# EAGLE design proto-small (EAGLE 6.5.0)
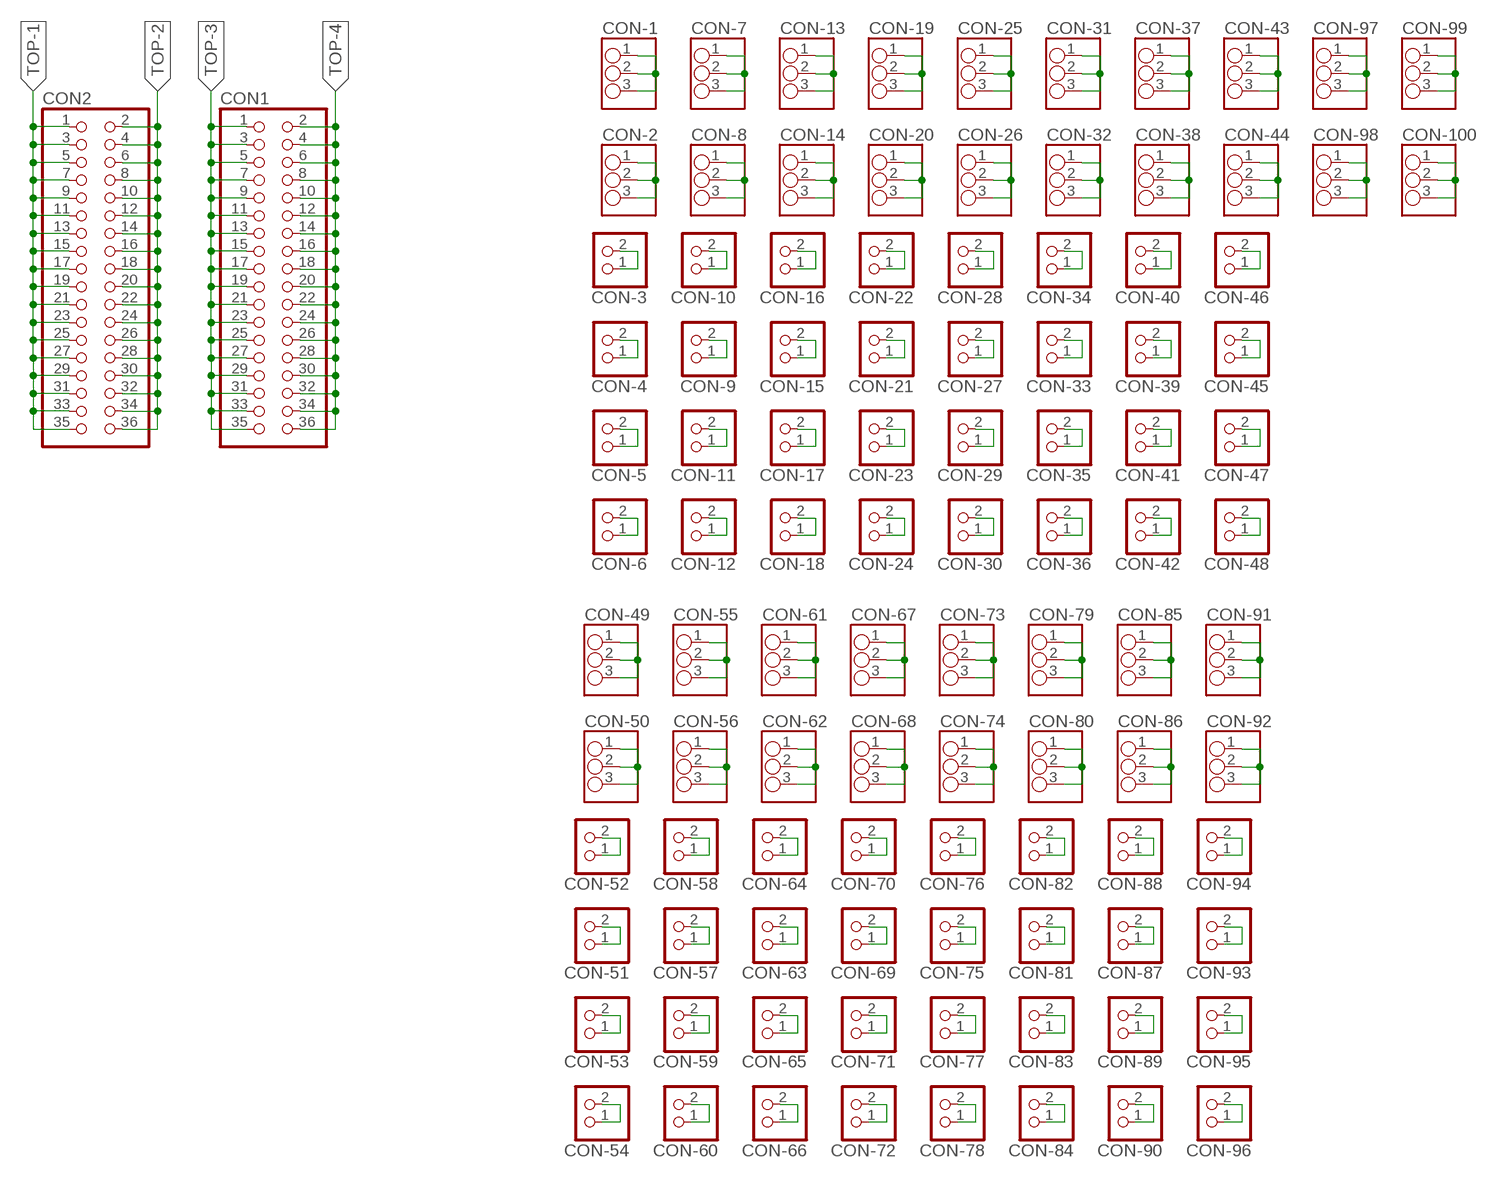
[diagram p0: schematic, sheet 1]

## Parts
CON1  GENERIC-2X18  [PINHEADER-100MIL-2X18-NOSILK]
CON2  GENERIC-2X18  [PINHEADER-100MIL-2X18-NOSILK]
CON-1  GENERIC-1X3  [PINHEADER-100MIL-1X3-NOSILK]
CON-2  GENERIC-1X3  [PINHEADER-100MIL-1X3-NOSILK]
CON-3  GENERIC-1X2  [PINHEADER-100MIL-1X2-NOSILK]
CON-4  GENERIC-1X2  [PINHEADER-100MIL-1X2-NOSILK]
CON-5  GENERIC-1X2  [PINHEADER-100MIL-1X2-NOSILK]
CON-6  GENERIC-1X2  [PINHEADER-100MIL-1X2-NOSILK]
CON-7  GENERIC-1X3  [PINHEADER-100MIL-1X3-NOSILK]
CON-8  GENERIC-1X3  [PINHEADER-100MIL-1X3-NOSILK]
CON-9  GENERIC-1X2  [PINHEADER-100MIL-1X2-NOSILK]
CON-10  GENERIC-1X2  [PINHEADER-100MIL-1X2-NOSILK]
CON-11  GENERIC-1X2  [PINHEADER-100MIL-1X2-NOSILK]
CON-12  GENERIC-1X2  [PINHEADER-100MIL-1X2-NOSILK]
CON-13  GENERIC-1X3  [PINHEADER-100MIL-1X3-NOSILK]
CON-14  GENERIC-1X3  [PINHEADER-100MIL-1X3-NOSILK]
CON-15  GENERIC-1X2  [PINHEADER-100MIL-1X2-NOSILK]
CON-16  GENERIC-1X2  [PINHEADER-100MIL-1X2-NOSILK]
CON-17  GENERIC-1X2  [PINHEADER-100MIL-1X2-NOSILK]
CON-18  GENERIC-1X2  [PINHEADER-100MIL-1X2-NOSILK]
CON-19  GENERIC-1X3  [PINHEADER-100MIL-1X3-NOSILK]
CON-20  GENERIC-1X3  [PINHEADER-100MIL-1X3-NOSILK]
CON-21  GENERIC-1X2  [PINHEADER-100MIL-1X2-NOSILK]
CON-22  GENERIC-1X2  [PINHEADER-100MIL-1X2-NOSILK]
CON-23  GENERIC-1X2  [PINHEADER-100MIL-1X2-NOSILK]
CON-24  GENERIC-1X2  [PINHEADER-100MIL-1X2-NOSILK]
CON-25  GENERIC-1X3  [PINHEADER-100MIL-1X3-NOSILK]
CON-26  GENERIC-1X3  [PINHEADER-100MIL-1X3-NOSILK]
CON-27  GENERIC-1X2  [PINHEADER-100MIL-1X2-NOSILK]
CON-28  GENERIC-1X2  [PINHEADER-100MIL-1X2-NOSILK]
CON-29  GENERIC-1X2  [PINHEADER-100MIL-1X2-NOSILK]
CON-30  GENERIC-1X2  [PINHEADER-100MIL-1X2-NOSILK]
CON-31  GENERIC-1X3  [PINHEADER-100MIL-1X3-NOSILK]
CON-32  GENERIC-1X3  [PINHEADER-100MIL-1X3-NOSILK]
CON-33  GENERIC-1X2  [PINHEADER-100MIL-1X2-NOSILK]
CON-34  GENERIC-1X2  [PINHEADER-100MIL-1X2-NOSILK]
CON-35  GENERIC-1X2  [PINHEADER-100MIL-1X2-NOSILK]
CON-36  GENERIC-1X2  [PINHEADER-100MIL-1X2-NOSILK]
CON-37  GENERIC-1X3  [PINHEADER-100MIL-1X3-NOSILK]
CON-38  GENERIC-1X3  [PINHEADER-100MIL-1X3-NOSILK]
CON-39  GENERIC-1X2  [PINHEADER-100MIL-1X2-NOSILK]
CON-40  GENERIC-1X2  [PINHEADER-100MIL-1X2-NOSILK]
CON-41  GENERIC-1X2  [PINHEADER-100MIL-1X2-NOSILK]
CON-42  GENERIC-1X2  [PINHEADER-100MIL-1X2-NOSILK]
CON-43  GENERIC-1X3  [PINHEADER-100MIL-1X3-NOSILK]
CON-44  GENERIC-1X3  [PINHEADER-100MIL-1X3-NOSILK]
CON-45  GENERIC-1X2  [PINHEADER-100MIL-1X2-NOSILK]
CON-46  GENERIC-1X2  [PINHEADER-100MIL-1X2-NOSILK]
CON-47  GENERIC-1X2  [PINHEADER-100MIL-1X2-NOSILK]
CON-48  GENERIC-1X2  [PINHEADER-100MIL-1X2-NOSILK]
CON-49  GENERIC-1X3  [PINHEADER-100MIL-1X3-NOSILK]
CON-50  GENERIC-1X3  [PINHEADER-100MIL-1X3-NOSILK]
CON-51  GENERIC-1X2  [PINHEADER-100MIL-1X2-NOSILK]
CON-52  GENERIC-1X2  [PINHEADER-100MIL-1X2-NOSILK]
CON-53  GENERIC-1X2  [PINHEADER-100MIL-1X2-NOSILK]
CON-54  GENERIC-1X2  [PINHEADER-100MIL-1X2-NOSILK]
CON-55  GENERIC-1X3  [PINHEADER-100MIL-1X3-NOSILK]
CON-56  GENERIC-1X3  [PINHEADER-100MIL-1X3-NOSILK]
CON-57  GENERIC-1X2  [PINHEADER-100MIL-1X2-NOSILK]
CON-58  GENERIC-1X2  [PINHEADER-100MIL-1X2-NOSILK]
CON-59  GENERIC-1X2  [PINHEADER-100MIL-1X2-NOSILK]
CON-60  GENERIC-1X2  [PINHEADER-100MIL-1X2-NOSILK]
CON-61  GENERIC-1X3  [PINHEADER-100MIL-1X3-NOSILK]
CON-62  GENERIC-1X3  [PINHEADER-100MIL-1X3-NOSILK]
CON-63  GENERIC-1X2  [PINHEADER-100MIL-1X2-NOSILK]
CON-64  GENERIC-1X2  [PINHEADER-100MIL-1X2-NOSILK]
CON-65  GENERIC-1X2  [PINHEADER-100MIL-1X2-NOSILK]
CON-66  GENERIC-1X2  [PINHEADER-100MIL-1X2-NOSILK]
CON-67  GENERIC-1X3  [PINHEADER-100MIL-1X3-NOSILK]
CON-68  GENERIC-1X3  [PINHEADER-100MIL-1X3-NOSILK]
CON-69  GENERIC-1X2  [PINHEADER-100MIL-1X2-NOSILK]
CON-70  GENERIC-1X2  [PINHEADER-100MIL-1X2-NOSILK]
CON-71  GENERIC-1X2  [PINHEADER-100MIL-1X2-NOSILK]
CON-72  GENERIC-1X2  [PINHEADER-100MIL-1X2-NOSILK]
CON-73  GENERIC-1X3  [PINHEADER-100MIL-1X3-NOSILK]
CON-74  GENERIC-1X3  [PINHEADER-100MIL-1X3-NOSILK]
CON-75  GENERIC-1X2  [PINHEADER-100MIL-1X2-NOSILK]
CON-76  GENERIC-1X2  [PINHEADER-100MIL-1X2-NOSILK]
CON-77  GENERIC-1X2  [PINHEADER-100MIL-1X2-NOSILK]
CON-78  GENERIC-1X2  [PINHEADER-100MIL-1X2-NOSILK]
CON-79  GENERIC-1X3  [PINHEADER-100MIL-1X3-NOSILK]
CON-80  GENERIC-1X3  [PINHEADER-100MIL-1X3-NOSILK]
CON-81  GENERIC-1X2  [PINHEADER-100MIL-1X2-NOSILK]
CON-82  GENERIC-1X2  [PINHEADER-100MIL-1X2-NOSILK]
CON-83  GENERIC-1X2  [PINHEADER-100MIL-1X2-NOSILK]
CON-84  GENERIC-1X2  [PINHEADER-100MIL-1X2-NOSILK]
CON-85  GENERIC-1X3  [PINHEADER-100MIL-1X3-NOSILK]
CON-86  GENERIC-1X3  [PINHEADER-100MIL-1X3-NOSILK]
CON-87  GENERIC-1X2  [PINHEADER-100MIL-1X2-NOSILK]
CON-88  GENERIC-1X2  [PINHEADER-100MIL-1X2-NOSILK]
CON-89  GENERIC-1X2  [PINHEADER-100MIL-1X2-NOSILK]
CON-90  GENERIC-1X2  [PINHEADER-100MIL-1X2-NOSILK]
CON-91  GENERIC-1X3  [PINHEADER-100MIL-1X3-NOSILK]
CON-92  GENERIC-1X3  [PINHEADER-100MIL-1X3-NOSILK]
CON-93  GENERIC-1X2  [PINHEADER-100MIL-1X2-NOSILK]
CON-94  GENERIC-1X2  [PINHEADER-100MIL-1X2-NOSILK]
CON-95  GENERIC-1X2  [PINHEADER-100MIL-1X2-NOSILK]
CON-96  GENERIC-1X2  [PINHEADER-100MIL-1X2-NOSILK]
CON-97  GENERIC-1X3  [PINHEADER-100MIL-1X3-NOSILK]
CON-98  GENERIC-1X3  [PINHEADER-100MIL-1X3-NOSILK]
CON-99  GENERIC-1X3  [PINHEADER-100MIL-1X3-NOSILK]
CON-100  GENERIC-1X3  [PINHEADER-100MIL-1X3-NOSILK]

## Nets
N$1: CON-1.1 CON-1.2 CON-1.3
N$2: CON-2.1 CON-2.2 CON-2.3
N$3: CON-3.1 CON-3.2
N$4: CON-7.1 CON-7.2 CON-7.3
N$5: CON-5.1 CON-5.2
N$6: CON-6.1 CON-6.2
N$7: CON-8.1 CON-8.2 CON-8.3
N$8: CON-10.1 CON-10.2
N$9: CON-11.1 CON-11.2
N$10: CON-12.1 CON-12.2
N$11: CON-13.1 CON-13.2 CON-13.3
N$12: CON-14.1 CON-14.2 CON-14.3
N$13: CON-16.1 CON-16.2
N$14: CON-17.1 CON-17.2
N$15: CON-18.1 CON-18.2
N$16: CON-19.1 CON-19.2 CON-19.3
N$17: CON-20.1 CON-20.2 CON-20.3
N$18: CON-22.1 CON-22.2
N$19: CON-23.1 CON-23.2
N$20: CON-24.1 CON-24.2
N$21: CON-25.1 CON-25.2 CON-25.3
N$22: CON-26.1 CON-26.2 CON-26.3
N$23: CON-28.1 CON-28.2
N$24: CON-29.1 CON-29.2
N$25: CON-30.1 CON-30.2
N$26: CON-31.1 CON-31.2 CON-31.3
N$27: CON-32.1 CON-32.2 CON-32.3
N$28: CON-34.1 CON-34.2
N$29: CON-35.1 CON-35.2
N$30: CON-36.1 CON-36.2
N$31: CON-37.1 CON-37.2 CON-37.3
N$32: CON-38.1 CON-38.2 CON-38.3
N$33: CON-40.1 CON-40.2
N$34: CON-41.1 CON-41.2
N$35: CON-42.1 CON-42.2
N$36: CON-43.1 CON-43.2 CON-43.3
N$37: CON-44.1 CON-44.2 CON-44.3
N$38: CON-46.1 CON-46.2
N$39: CON-47.1 CON-47.2
N$40: CON-48.1 CON-48.2
N$41: CON-49.1 CON-49.2 CON-49.3
N$42: CON-50.1 CON-50.2 CON-50.3
N$43: CON-52.1 CON-52.2
N$44: CON-53.1 CON-53.2
N$45: CON-54.1 CON-54.2
N$46: CON-55.1 CON-55.2 CON-55.3
N$47: CON-56.1 CON-56.2 CON-56.3
N$48: CON-58.1 CON-58.2
N$49: CON-59.1 CON-59.2
N$50: CON-60.1 CON-60.2
N$51: CON-61.1 CON-61.2 CON-61.3
N$52: CON-62.1 CON-62.2 CON-62.3
N$53: CON-64.1 CON-64.2
N$54: CON-65.1 CON-65.2
N$55: CON-66.1 CON-66.2
N$56: CON-67.1 CON-67.2 CON-67.3
N$57: CON-68.1 CON-68.2 CON-68.3
N$58: CON-70.1 CON-70.2
N$59: CON-71.1 CON-71.2
N$60: CON-72.1 CON-72.2
N$61: CON-73.1 CON-73.2 CON-73.3
N$62: CON-74.1 CON-74.2 CON-74.3
N$63: CON-76.1 CON-76.2
N$64: CON-77.1 CON-77.2
N$65: CON-78.1 CON-78.2
N$66: CON-79.1 CON-79.2 CON-79.3
N$67: CON-80.1 CON-80.2 CON-80.3
N$68: CON-82.1 CON-82.2
N$69: CON-83.1 CON-83.2
N$70: CON-84.1 CON-84.2
N$71: CON-85.1 CON-85.2 CON-85.3
N$72: CON-86.1 CON-86.2 CON-86.3
N$73: CON-88.1 CON-88.2
N$74: CON-89.1 CON-89.2
N$75: CON-90.1 CON-90.2
N$76: CON-91.1 CON-91.2 CON-91.3
N$77: CON-92.1 CON-92.2 CON-92.3
N$78: CON-94.1 CON-94.2
N$79: CON-95.1 CON-95.2
N$80: CON-96.1 CON-96.2
N$81: CON-97.1 CON-97.2 CON-97.3
N$82: CON-98.1 CON-98.2 CON-98.3
N$83: CON-99.1 CON-99.2 CON-99.3
N$84: CON-100.1 CON-100.2 CON-100.3
N$-1: CON-9.1 CON-9.2
N$-2: CON-15.1 CON-15.2
N$-3: CON-21.1 CON-21.2
N$-4: CON-4.1 CON-4.2
N$-5: CON-27.1 CON-27.2
N$-6: CON-33.1 CON-33.2
N$-7: CON-39.1 CON-39.2
N$-8: CON-45.1 CON-45.2
N$-9: CON-51.1 CON-51.2
N$-10: CON-57.1 CON-57.2
N$-11: CON-63.1 CON-63.2
N$-12: CON-69.1 CON-69.2
N$-13: CON-75.1 CON-75.2
N$-14: CON-81.1 CON-81.2
N$-15: CON-87.1 CON-87.2
N$-16: CON-93.1 CON-93.2
TOP-1: CON2.1 CON2.3 CON2.5 CON2.7 CON2.9 CON2.11 CON2.13 CON2.15 CON2.17 CON2.19 CON2.21 CON2.23 CON2.25 CON2.27 CON2.29 CON2.31 CON2.33 CON2.35
TOP-2: CON2.2 CON2.4 CON2.6 CON2.8 CON2.10 CON2.12 CON2.14 CON2.16 CON2.18 CON2.20 CON2.22 CON2.24 CON2.26 CON2.28 CON2.30 CON2.32 CON2.34 CON2.36
TOP-3: CON1.1 CON1.3 CON1.5 CON1.7 CON1.9 CON1.11 CON1.13 CON1.15 CON1.17 CON1.19 CON1.21 CON1.23 CON1.25 CON1.27 CON1.29 CON1.31 CON1.33 CON1.35
TOP-4: CON1.2 CON1.4 CON1.6 CON1.8 CON1.10 CON1.12 CON1.14 CON1.16 CON1.18 CON1.20 CON1.22 CON1.24 CON1.26 CON1.28 CON1.30 CON1.32 CON1.34 CON1.36

## Library data of the parts
CON1 CON2 = p.peter-connectors:GENERIC-2X18
CON-1 CON-2 CON-7 CON-8 CON-13 CON-14 CON-19 CON-20 CON-25 CON-26 CON-31 CON-32 CON-37 CON-38 CON-43 CON-44 CON-49 CON-50 CON-55 CON-56 CON-61 CON-62 CON-67 CON-68 CON-73 CON-74 CON-79 CON-80 CON-85 CON-86 CON-91 CON-92 CON-97-CON-100 = p.peter-connectors:GENERIC-1X3
CON-3-CON-6 CON-9-CON-12 CON-15-CON-18 CON-21-CON-24 CON-27-CON-30 CON-33-CON-36 CON-39-CON-42 CON-45-CON-48 CON-51-CON-54 CON-57-CON-60 CON-63-CON-66 CON-69-CON-72 CON-75-CON-78 CON-81-CON-84 CON-87-CON-90 CON-93-CON-96 = p.peter-connectors:GENERIC-1X2

## Board
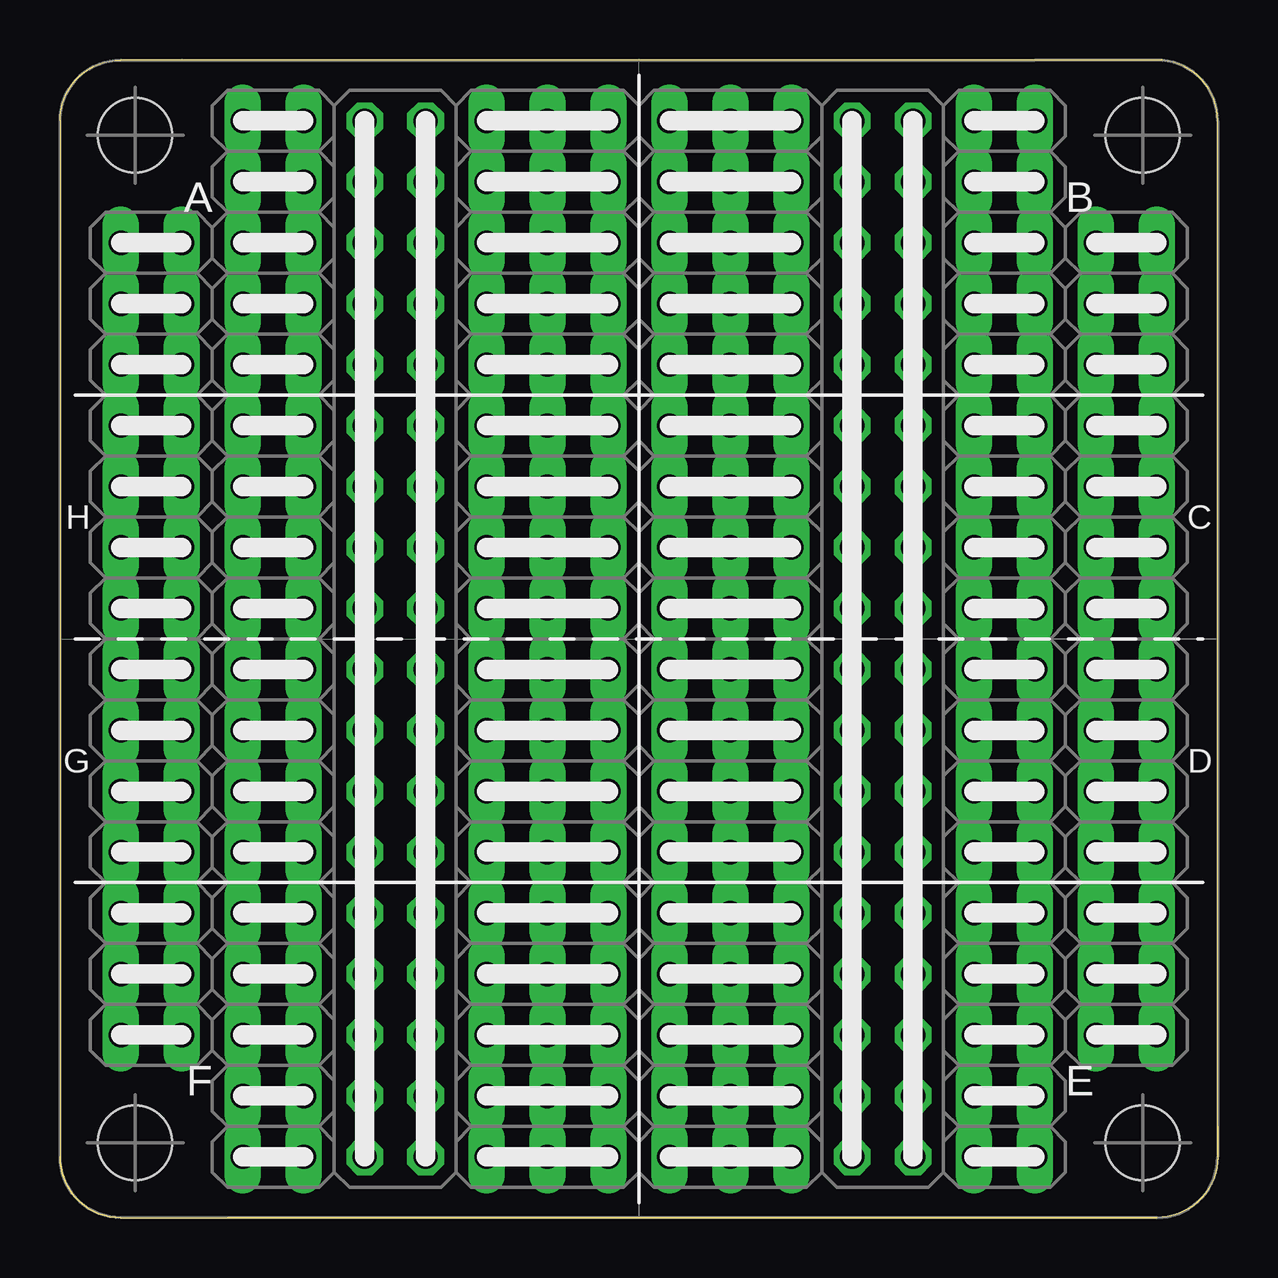
[diagram p1: board, top side]
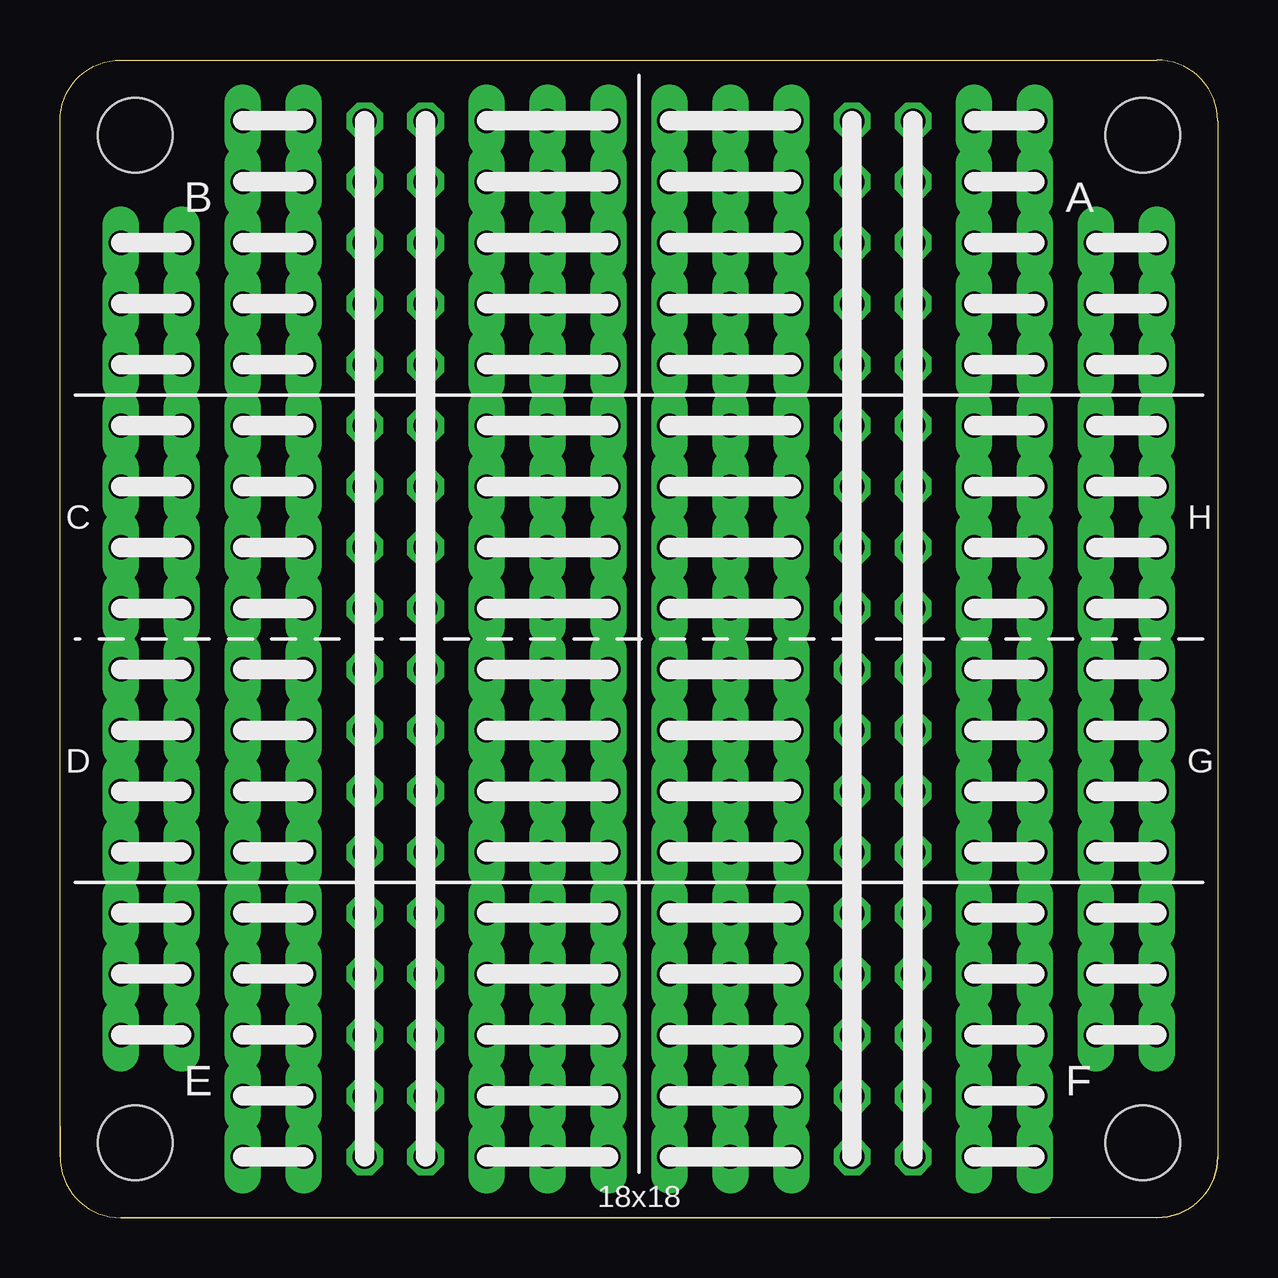
[diagram p2: board, bottom side, seen from below]

Size 48.26 x 48.26 mm. Coordinates in mm from the lower left corner, seen from the top.
Outline: 2.54,0 45.72,0
Outline: 48.26,2.54 48.26,45.72 arc90 45.72,48.26 2.54,48.26 arc90 0,45.72 0,2.54
Outline: 48.26,2.54 arc-90 45.72,0
Outline: 0,2.54 arc90 2.54,0
Outline: 2.54,0 6.99,0 43.81,0 45.72,0
Outline: 48.26,2.54 48.26,3.81 48.26,6.35
Outline: 48.26,2.54 arc-90 45.72,0
Outline: 2.54,0 arc-90 0,2.54
Copper layers (1*16): Top 0.0356mm / dielectric 1.5011mm / Bottom 0.0356mm
Design rules "breadboard": minimum track width 6mil, minimum drill 13mil, track to track 6mil, track to pad 6mil, pad to pad 6mil, via to via 6mil, smd to smd 6mil, copper to edge 15mil, drill to drill 6mil, minimum pad ring 8mil, minimum via ring 7mil, stop-mask expansion 4mil, vias tented up to drill 4.1mm, thermal gap 10mil
Holes 3.1 mm at 3.13,3.13 3.13,45.13 45.13,45.13 45.13,3.13

### Footprints (pad centres in the part's own frame; a part is rotated, then mirrored left to right if it is on the bottom)
PINHEADER-100MIL-2X18-NOSILK = drill 1.016 octagon: 1 -21.59,-1.27; 2 -21.59,1.27; 3 -19.05,-1.27; 4 -19.05,1.27; 5 -16.51,-1.27; 6 -16.51,1.27; 7 -13.97,-1.27; 8 -13.97,1.27; 9 -11.43,-1.27; 10 -11.43,1.27; 11 -8.89,-1.27; 12 -8.89,1.27; 13 -6.35,-1.27; 14 -6.35,1.27; 15 -3.81,-1.27; 16 -3.81,1.27; 17 -1.27,-1.27; 18 -1.27,1.27; 19 1.27,-1.27; 20 1.27,1.27; 21 3.81,-1.27; 22 3.81,1.27; 23 6.35,-1.27; 24 6.35,1.27; 25 8.89,-1.27; 26 8.89,1.27; 27 11.43,-1.27; 28 11.43,1.27; 29 13.97,-1.27; 30 13.97,1.27; 31 16.51,-1.27; 32 16.51,1.27; 33 19.05,-1.27; 34 19.05,1.27; 35 21.59,-1.27; 36 21.59,1.27
PINHEADER-100MIL-1X3-NOSILK = drill 1.016 long: 1 -2.54,0; 2 0,0; 3 2.54,0
PINHEADER-100MIL-1X2-NOSILK = drill 1.016 long: 1 -1.27,0; 2 1.27,0

### Placement (x,y rotation side)
CON1  34.29,24.13 90 top
CON2  13.97,24.13 90 top
CON-1  27.94,7.62 180 top
CON-2  27.94,25.4 180 top
CON-3  8.89,7.62 0 top
CON-4  39.37,7.62 0 top
CON-5  44.45,7.62 0 top
CON-6  3.81,7.62 0 top
CON-7  20.32,25.4 0 top
CON-8  20.32,7.62 0 top
CON-9  3.81,10.16 0 top
CON-10  3.81,12.7 0 top
CON-11  8.89,10.16 0 top
CON-12  8.89,12.7 0 top
CON-13  20.32,10.16 0 top
CON-14  27.94,10.16 0 top
CON-15  39.37,10.16 0 top
CON-16  44.45,10.16 0 top
CON-17  39.37,12.7 0 top
CON-18  44.45,12.7 0 top
CON-19  20.32,12.7 0 top
CON-20  27.94,12.7 0 top
CON-21  3.81,15.24 0 top
CON-22  8.89,15.24 0 top
CON-23  39.37,15.24 0 top
CON-24  44.45,15.24 0 top
CON-25  20.32,15.24 0 top
CON-26  27.94,15.24 0 top
CON-27  3.81,17.78 0 top
CON-28  3.81,20.32 0 top
CON-29  3.81,22.86 0 top
CON-30  8.89,17.78 0 top
CON-31  20.32,17.78 0 top
CON-32  27.94,17.78 0 top
CON-33  8.89,20.32 0 top
CON-34  8.89,22.86 0 top
CON-35  3.81,25.4 0 top
CON-36  39.37,17.78 0 top
CON-37  20.32,20.32 0 top
CON-38  27.94,20.32 0 top
CON-39  44.45,17.78 0 top
CON-40  39.37,20.32 0 top
CON-41  44.45,25.4 0 top
CON-42  8.89,25.4 0 top
CON-43  20.32,22.86 0 top
CON-44  27.94,22.86 0 top
CON-45  39.37,22.86 0 top
CON-46  44.45,20.32 0 top
CON-47  44.45,22.86 0 top
CON-48  39.37,25.4 0 top
CON-49  20.32,27.94 0 top
CON-50  27.94,27.94 0 top
CON-51  3.81,27.94 0 top
CON-52  8.89,27.94 0 top
CON-53  3.81,30.48 0 top
CON-54  8.89,30.48 0 top
CON-55  20.32,30.48 0 top
CON-56  27.94,30.48 0 top
CON-57  3.81,33.02 0 top
CON-58  8.89,33.02 0 top
CON-59  3.81,35.56 0 top
CON-60  8.89,35.56 0 top
CON-61  27.94,38.1 0 top
CON-62  20.32,33.02 0 top
CON-63  8.89,38.1 0 top
CON-64  3.81,40.64 0 top
CON-65  8.89,40.64 0 top
CON-66  44.45,27.94 0 top
CON-67  27.94,33.02 0 top
CON-68  20.32,35.56 0 top
CON-69  39.37,30.48 0 top
CON-70  44.45,30.48 0 top
CON-71  39.37,33.02 0 top
CON-72  3.81,38.1 0 top
CON-73  27.94,35.56 0 top
CON-74  20.32,38.1 0 top
CON-75  39.37,27.94 0 top
CON-76  44.45,33.02 0 top
CON-77  39.37,35.56 0 top
CON-78  39.37,38.1 0 top
CON-79  20.32,40.64 0 top
CON-80  20.32,43.18 0 top
CON-81  39.37,40.64 0 top
CON-82  44.45,40.64 0 top
CON-83  8.89,43.18 0 top
CON-84  39.37,43.18 0 top
CON-85  27.94,40.64 0 top
CON-86  27.94,43.18 0 top
CON-87  44.45,35.56 0 top
CON-88  44.45,38.1 0 top
CON-89  8.89,5.08 0 top
CON-90  39.37,5.08 0 top
CON-91  20.32,5.08 0 top
CON-92  27.94,5.08 0 top
CON-93  39.37,45.72 0 top
CON-94  8.89,45.72 0 top
CON-95  8.89,2.54 0 top
CON-96  39.37,2.54 0 top
CON-97  20.32,45.72 0 top
CON-98  27.94,45.72 0 top
CON-99  20.32,2.54 0 top
CON-100  27.94,2.54 0 top
U$1  [OUTLINE-SOB-5X5-IMPERIAL]  0,0 0 top

### Tracks (layer width: path | path; a pad name or v marks a point on that pad's centre or on a via)
N$1
  Bottom 0.813: CON-1.3 CON-1.2 CON-1.1
N$2
  Bottom 0.813: CON-2.3 CON-2.2 CON-2.1
N$3
  Bottom 0.813: CON-3.2 CON-3.1
N$4
  Bottom 0.813: CON-7.1 CON-7.2 CON-7.3
N$5
  Bottom 0.813: CON-5.2 CON-5.1
N$6
  Bottom 0.813: CON-6.2 CON-6.1
N$7
  Bottom 0.813: CON-8.1 CON-8.2 CON-8.3
N$8
  Bottom 0.813: CON-10.2 CON-10.1
N$9
  Bottom 0.813: CON-11.2 CON-11.1
N$10
  Bottom 0.813: CON-12.2 CON-12.1
N$11
  Bottom 0.813: CON-13.1 CON-13.2 CON-13.3
N$12
  Bottom 0.813: CON-14.1 CON-14.2 CON-14.3
N$13
  Bottom 0.813: CON-16.2 CON-16.1
N$14
  Bottom 0.813: CON-17.2 CON-17.1
N$15
  Bottom 0.813: CON-18.2 CON-18.1
N$16
  Bottom 0.813: CON-19.1 CON-19.2 CON-19.3
N$17
  Bottom 0.813: CON-20.1 CON-20.2 CON-20.3
N$18
  Bottom 0.813: CON-22.2 CON-22.1
N$19
  Bottom 0.813: CON-23.2 CON-23.1
N$20
  Bottom 0.813: CON-24.2 CON-24.1
N$21
  Bottom 0.813: CON-25.1 CON-25.2 CON-25.3
N$22
  Bottom 0.813: CON-26.1 CON-26.2 CON-26.3
N$23
  Bottom 0.813: CON-28.2 CON-28.1
N$24
  Bottom 0.813: CON-29.2 CON-29.1
N$25
  Bottom 0.813: CON-30.2 CON-30.1
N$26
  Bottom 0.813: CON-31.1 CON-31.2 CON-31.3
N$27
  Bottom 0.813: CON-32.1 CON-32.2 CON-32.3
N$28
  Bottom 0.813: CON-34.2 CON-34.1
N$29
  Bottom 0.813: CON-35.2 CON-35.1
N$30
  Bottom 0.813: CON-36.2 CON-36.1
N$31
  Bottom 0.813: CON-37.1 CON-37.2 CON-37.3
N$32
  Bottom 0.813: CON-38.1 CON-38.2 CON-38.3
N$33
  Bottom 0.813: CON-40.2 CON-40.1
N$34
  Bottom 0.813: CON-41.2 CON-41.1
N$35
  Bottom 0.813: CON-42.2 CON-42.1
N$36
  Bottom 0.813: CON-43.1 CON-43.2 CON-43.3
N$37
  Bottom 0.813: CON-44.1 CON-44.2 CON-44.3
N$38
  Bottom 0.813: CON-46.2 CON-46.1
N$39
  Bottom 0.813: CON-47.2 CON-47.1
N$40
  Bottom 0.813: CON-48.2 CON-48.1
N$41
  Bottom 0.813: CON-49.1 CON-49.2 CON-49.3
N$42
  Bottom 0.813: CON-50.1 CON-50.2 CON-50.3
N$43
  Bottom 0.813: CON-52.2 CON-52.1
N$44
  Bottom 0.813: CON-53.2 CON-53.1
N$45
  Bottom 0.813: CON-54.2 CON-54.1
N$46
  Bottom 0.813: CON-55.1 CON-55.2 CON-55.3
N$47
  Bottom 0.813: CON-56.1 CON-56.2 CON-56.3
N$48
  Bottom 0.813: CON-58.2 CON-58.1
N$49
  Bottom 0.813: CON-59.2 CON-59.1
N$50
  Bottom 0.813: CON-60.2 CON-60.1
N$51
  Bottom 0.813: CON-61.1 CON-61.2 CON-61.3
N$52
  Bottom 0.813: CON-62.1 CON-62.2 CON-62.3
N$53
  Bottom 0.813: CON-64.2 CON-64.1
N$54
  Bottom 0.813: CON-65.2 CON-65.1
N$55
  Bottom 0.813: CON-66.2 CON-66.1
N$56
  Bottom 0.813: CON-67.1 CON-67.2 CON-67.3
N$57
  Bottom 0.813: CON-68.1 CON-68.2 CON-68.3
N$58
  Bottom 0.813: CON-70.2 CON-70.1
N$59
  Bottom 0.813: CON-71.2 CON-71.1
N$60
  Bottom 0.813: CON-72.2 CON-72.1
N$61
  Bottom 0.813: CON-73.1 CON-73.2 CON-73.3
N$62
  Bottom 0.813: CON-74.1 CON-74.2 CON-74.3
N$63
  Bottom 0.813: CON-76.2 CON-76.1
N$64
  Bottom 0.813: CON-77.2 CON-77.1
N$65
  Bottom 0.813: CON-78.2 CON-78.1
N$66
  Bottom 0.813: CON-79.1 CON-79.2 CON-79.3
N$67
  Bottom 0.813: CON-80.1 CON-80.2 CON-80.3
N$68
  Bottom 0.813: CON-82.2 CON-82.1
N$69
  Bottom 0.813: CON-83.2 CON-83.1
N$70
  Bottom 0.813: CON-84.2 CON-84.1
N$71
  Bottom 0.813: CON-85.1 CON-85.2 CON-85.3
N$72
  Bottom 0.813: CON-86.1 CON-86.2 CON-86.3
N$73
  Bottom 0.813: CON-88.2 CON-88.1
N$74
  Bottom 0.813: CON-89.2 CON-89.1
N$75
  Bottom 0.813: CON-90.2 CON-90.1
N$76
  Bottom 0.813: CON-91.1 CON-91.2 CON-91.3
N$77
  Bottom 0.813: CON-92.1 CON-92.2 CON-92.3
N$78
  Bottom 0.813: CON-94.2 CON-94.1
N$79
  Bottom 0.813: CON-95.2 CON-95.1
N$80
  Bottom 0.813: CON-96.2 CON-96.1
N$81
  Bottom 0.813: CON-97.1 CON-97.2 CON-97.3
N$82
  Bottom 0.813: CON-98.1 CON-98.2 CON-98.3
N$83
  Bottom 0.813: CON-99.1 CON-99.2 CON-99.3
N$84
  Bottom 0.813: CON-100.1 CON-100.2 CON-100.3
N$-1
  Bottom 0.813: CON-9.2 CON-9.1
N$-2
  Bottom 0.813: CON-15.2 CON-15.1
N$-3
  Bottom 0.813: CON-21.2 CON-21.1
N$-4
  Bottom 0.813: CON-4.2 CON-4.1
N$-5
  Bottom 0.813: CON-27.2 CON-27.1
N$-6
  Bottom 0.813: CON-33.2 CON-33.1
N$-7
  Bottom 0.813: CON-39.2 CON-39.1
N$-8
  Bottom 0.813: CON-45.2 CON-45.1
N$-9
  Bottom 0.813: CON-51.2 CON-51.1
N$-10
  Bottom 0.813: CON-57.2 CON-57.1
N$-11
  Bottom 0.813: CON-63.2 CON-63.1
N$-12
  Bottom 0.813: CON-69.2 CON-69.1
N$-13
  Bottom 0.813: CON-75.2 CON-75.1
N$-14
  Bottom 0.813: CON-81.2 CON-81.1
N$-15
  Bottom 0.813: CON-87.2 CON-87.1
N$-16
  Bottom 0.813: CON-93.2 CON-93.1
TOP-1
  Bottom 0.813: CON2.35 CON2.33 CON2.31 CON2.29 CON2.27 CON2.25 CON2.23 CON2.21 CON2.19 CON2.17 CON2.15 CON2.13 CON2.11 CON2.9 CON2.7 CON2.5 CON2.3 CON2.1
TOP-2
  Bottom 0.813: CON2.36 CON2.34 CON2.32 CON2.30 CON2.28 CON2.26 CON2.24 CON2.22 CON2.20 CON2.18 CON2.16 CON2.14 CON2.12 CON2.10 CON2.8 CON2.6 CON2.4 CON2.2
TOP-3
  Bottom 0.813: CON1.35 CON1.33 CON1.31 CON1.29 CON1.27 CON1.25 CON1.23 CON1.21 CON1.19 CON1.17 CON1.15 CON1.13 CON1.11 CON1.9 CON1.7 CON1.5 CON1.3 CON1.1
TOP-4
  Bottom 0.813: CON1.36 CON1.34 CON1.32 CON1.30 CON1.28 CON1.26 CON1.24 CON1.22 CON1.20 CON1.18 CON1.16 CON1.14 CON1.12 CON1.10 CON1.8 CON1.6 CON1.4 CON1.2

### Text on the board
tPlace: A | A | B | H | C | G | D | F | E
bPlace: A | B | H | C | G | D | F | E | 18x18